# EAGLE design connector (EAGLE 6.0)
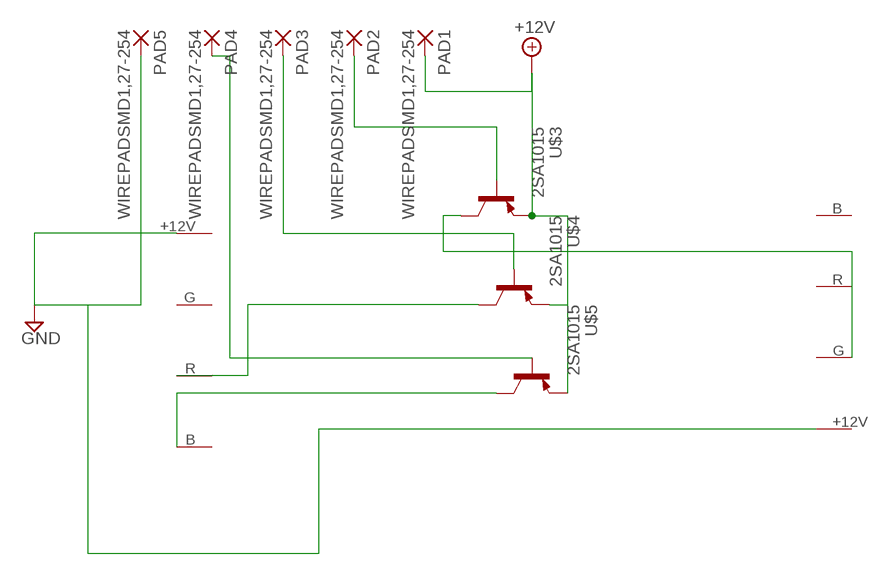
[diagram p0: schematic, sheet 1]

## Parts
PAD1  WIREPADSMD1,27-254  [SMD1,27-2,54]
PAD2  WIREPADSMD1,27-254  [SMD1,27-2,54]
PAD3  WIREPADSMD1,27-254  [SMD1,27-2,54]
PAD4  WIREPADSMD1,27-254  [SMD1,27-2,54]
PAD5  WIREPADSMD1,27-254  [SMD1,27-2,54]
U$1  LED_STRIP_SOLDER_PAD  [STRIP]
U$2  LED_STRIP_SOLDER_PAD  [STRIP]
U$3  2SA1015  [TO92-EBC]
U$4  2SA1015  [TO92-EBC]
U$5  2SA1015  [TO92-EBC]

## Nets
+12V: PAD1.1(P) U$3.E U$4.E U$5.E
GND: PAD5.1(P) U$2.+12V
N$1: U$2.B U$5.C
N$2: U$2.R U$4.C
N$3: U$1.G U$3.C
N$5: PAD2.1(P) U$3.B
N$6: PAD3.1(P) U$4.B
N$7: PAD4.1(P) U$5.B
Unconnected: U$1.+12V U$1.B U$1.R U$2.G

## Library data of the parts
PAD1-PAD5 = wirepad:WIREPAD: Wire PAD connect wire on PCB
U$1 U$2 = RobThePyro:LED_STRIP_SOLDER_PAD: Pad's for connecting led strip
U$3-U$5 = transistor-pnp:2SA1015

## Board
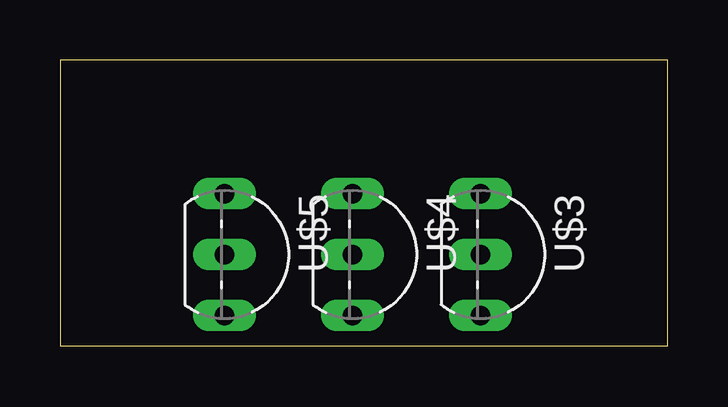
[diagram p1: board, top side]
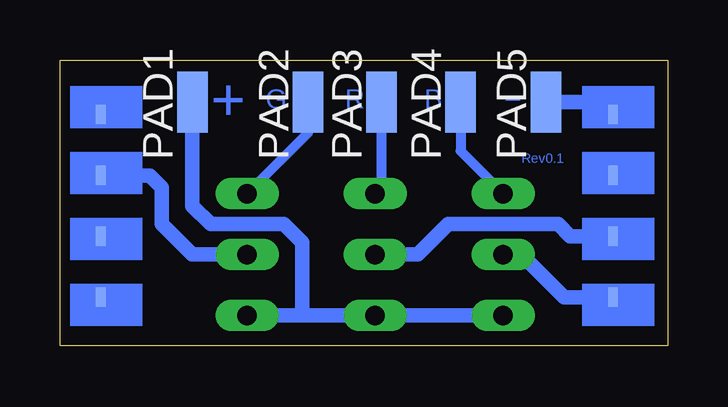
[diagram p2: board, bottom side, seen from below]

Size 25.32 x 11.93 mm. Coordinates in mm from the lower left corner, seen from the top.
Outline: 0,0 25.32,0 25.32,11.93 0,11.93 0,0
Copper layers (1*16): Top 0.035mm / dielectric 1.5mm / Bottom 0.035mm
Design rules: minimum track width 10mil, minimum drill 24mil, track to track 8mil, track to pad 8mil, pad to pad 8mil, via to via 8mil, smd to smd 8mil, copper to edge 40mil, drill to drill 8mil, minimum pad ring 10mil, minimum via ring 8mil, stop-mask expansion 4mil, vias tented up to drill 0mil, thermal gap 10mil

### Footprints (pad centres in the part's own frame; a part is rotated, then mirrored left to right if it is on the bottom)
SMD1,27-2,54 = smd 1.27 x 2.54: 1 0,0
STRIP = smd 0.813 x 0.406: +12V 3.81,-1.27; B -3.81,-1.27; G 1.27,-1.27; R -1.27,-1.27
TO92-EBC = drill 0.813 long: B -2.54,-1.27; C 0,-1.27; E 2.54,-1.27

### Placement (x,y rotation side)
PAD1  19.81,10.16 0 bottom
PAD2  14.99,10.16 0 bottom
PAD3  11.94,10.16 0 bottom
PAD4  8.64,10.16 0 bottom
PAD5  5.08,10.16 0 bottom
U$1  24.89,5.84 90 bottom
U$2  3.56,5.84 90 bottom
U$3  18.8,3.81 270 top
U$4  13.46,3.81 270 top
U$5  8.13,3.81 270 top

### Tracks (layer width: path | path; a pad name or v marks a point on that pad's centre or on a via)
+12V
  Bottom 0.61: U$5.E U$4.E U$3.E 15.24,1.27 15.24,4.32 16,5.08 19.05,5.08 19.81,5.84 PAD1.1
GND
  Bottom 0.61: PAD5.1 2.79,10.16 U$2.+12V
N$1
  Bottom 0.61: U$5.C 6.1,3.81 4.32,2.03 U$2.B
N$2
  Bottom 0.61: U$4.C 10.41,3.81 9.14,5.08 4.57,5.08 4.06,4.57 U$2.R
N$3
  Bottom 0.61: U$3.C 19.81,3.81 21.08,5.08 21.08,6.6 21.59,7.11 U$1.G
N$5
  Bottom 0.406: PAD2.1 14.99,8.89 U$3.B
N$6
  Bottom 0.406: PAD3.1 11.94,6.6 U$4.B
N$7
  Bottom 0.406: PAD4.1 8.64,8.13 U$5.B

### Text on the board
Bottom: B | R | G | - | + | Rev0.1